# Altium schematic sheet inputSignalPins.SchDoc
size A4
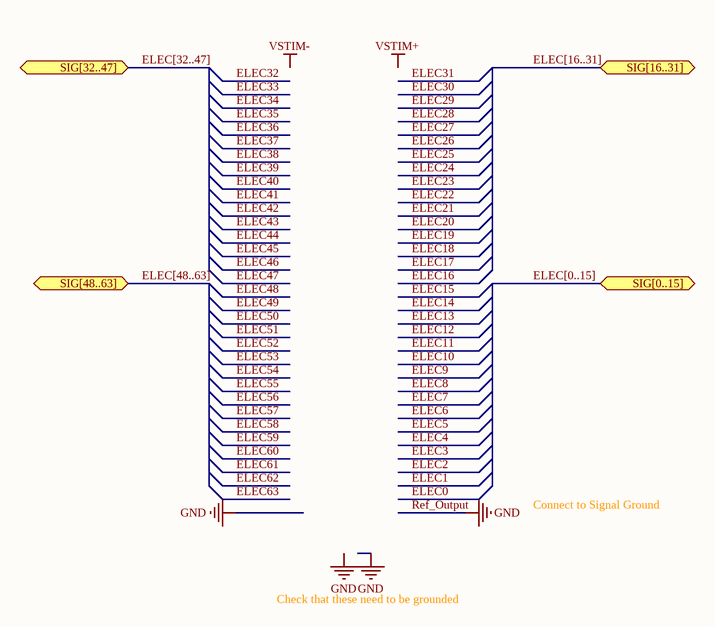
[diagram p0: inputSignalPins.SchDoc]

## Ports
SIG[0..15] (bidir), SIG[16..31] (bidir), SIG[32..47] (bidir), SIG[48..63] (bidir)

## Buses and harness runs
bus ELEC[0..15] = port SIG[0..15]
bus ELEC[16..31] = port SIG[16..31]
bus ELEC[32..47] = port SIG[32..47]
bus ELEC[48..63] = port SIG[48..63]

## Notes on the sheet
- Connect to Signal Ground
- Check that these need to be grounded
- Labels drawn without touching a wire or pin: GND, VSTIM+, VSTIM-